# Altium schematic sheet SCH_Display-Button_Altium.schdoc
size 182 x 126 mm
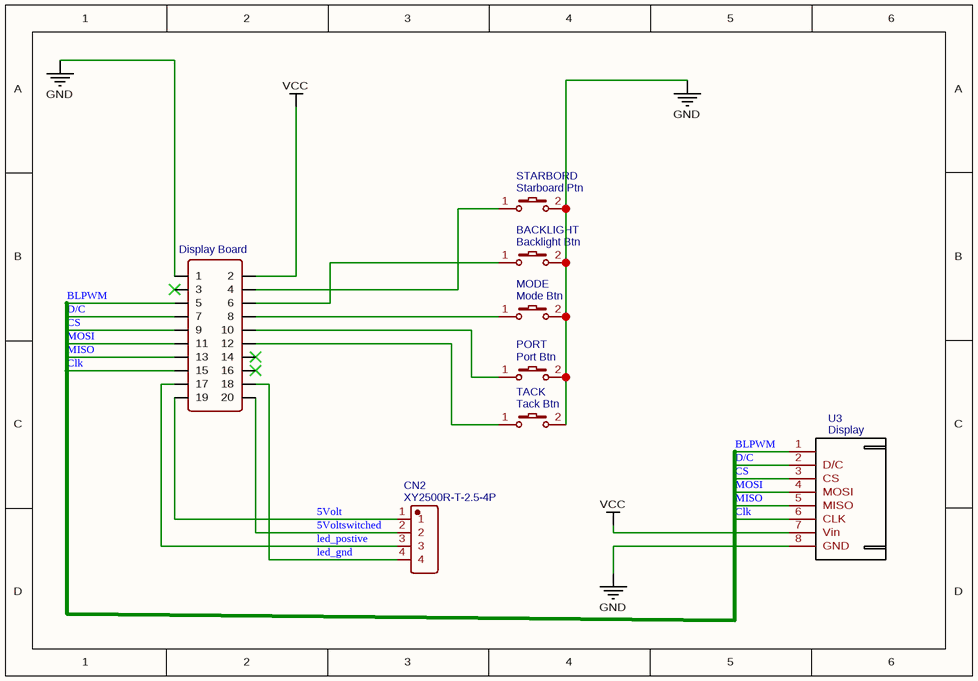
[diagram p0: SCH_Display-Button_Altium.schdoc]

## Parts
BACKLIGHT  Backlight Btn  [KEY-SMD_2P-L6.2-W3.6-LS8.0]
BUTTON_LED1  Display Board  [HDR-M-2.54_2X10]
CN2  XY2500R-T-2.5-4P  [CONN-TH_XY2500R-T-2.5-4P]
MODE  Mode Btn  [KEY-SMD_2P-L6.2-W3.6-LS8.0]
PORT  Port Btn  [KEY-SMD_2P-L6.2-W3.6-LS8.0]
STARBORD  Starboard Ptn  [KEY-SMD_2P-L6.2-W3.6-LS8.0]
TACK  Tack Btn  [KEY-SMD_2P-L6.2-W3.6-LS8.0]
U3  Display  [JST-XH-8-PIN]

## Nets
GND: BACKLIGHT.2 BUTTON_LED1.1 MODE.2 PORT.2 STARBORD.2 TACK.2 U3.8(GND)
VCC: BUTTON_LED1.2 U3.7(Vin)
5Volt: BUTTON_LED1.19 CN2.1
5Voltswitched: BUTTON_LED1.20 CN2.2
BLPWM: BUTTON_LED1.5 U3.1
Clk: BUTTON_LED1.15 U3.6(CLK)
CS: BUTTON_LED1.9 U3.3(CS)
D/C: BUTTON_LED1.7 U3.2(D/C)
led_gnd: BUTTON_LED1.18 CN2.4
led_postive: BUTTON_LED1.17 CN2.3
MISO: BUTTON_LED1.13 U3.5(MISO)
MOSI: BUTTON_LED1.11 U3.4(MOSI)
NetBACKLIGHT_1: BACKLIGHT.1 BUTTON_LED1.6
NetBUTTON_LED1_4: BUTTON_LED1.4 STARBORD.1
NetBUTTON_LED1_8: BUTTON_LED1.8 MODE.1
NetBUTTON_LED1_10: BUTTON_LED1.10 PORT.1
NetBUTTON_LED1_12: BUTTON_LED1.12 TACK.1

Not connected (* = marked no-connect by the designer): BUTTON_LED1 3* 14* 16*

## Library data of the parts
BACKLIGHT = Backlight Btn: Manufacturer Part: K2-1107ST-A4SW-06; Contributor: LCEDA_Lib; 制造商: 韩国韩荣; Supplier Part: C118141; Supplier: LCSC; spicePre: K; spiceSymbolName: K2-3.6×6.1_SMD
BUTTON_LED1 = Display Board: Contributor: LCEDA_Lib; Supplier Part: C124359; Supplier: LCSC; spicePre: J; spiceSymbolName: HDR-M-2.54_2x10
CN2 = XY2500R-T-2.5-4P: Manufacturer: XINLAIYA(新莱亚); Contributor: LCSC; Supplier: LCSC; Supplier Part: C784963; Manufacturer Part: XY2500R-T-2.5-4P; JLCPCB Part Class: Extended Part; spicePre: C; spiceSymbolName: XY2500R-T-2.5-4P
MODE = Mode Btn: Manufacturer Part: K2-1107ST-A4SW-06; Contributor: LCEDA_Lib; 制造商: 韩国韩荣; Supplier Part: C118141; Supplier: LCSC; spicePre: K; spiceSymbolName: K2-3.6×6.1_SMD
PORT = Port Btn: Manufacturer Part: K2-1107ST-A4SW-06; Contributor: LCEDA_Lib; 制造商: 韩国韩荣; Supplier Part: C118141; Supplier: LCSC; spicePre: K; spiceSymbolName: K2-3.6×6.1_SMD
STARBORD = Starboard Ptn: Manufacturer Part: K2-1107ST-A4SW-06; Contributor: LCEDA_Lib; 制造商: 韩国韩荣; Supplier Part: C118141; Supplier: LCSC; spicePre: K; spiceSymbolName: K2-3.6×6.1_SMD
TACK = Tack Btn: Manufacturer Part: K2-1107ST-A4SW-06; Contributor: LCEDA_Lib; 制造商: 韩国韩荣; Supplier Part: C118141; Supplier: LCSC; spicePre: K; spiceSymbolName: K2-3.6×6.1_SMD
U3 = Display: Contributor: loyboy; spicePre: U; spiceSymbolName: JST-XH-8-Pin